# Altium schematic sheet P07_eMMC.SchDoc
size A
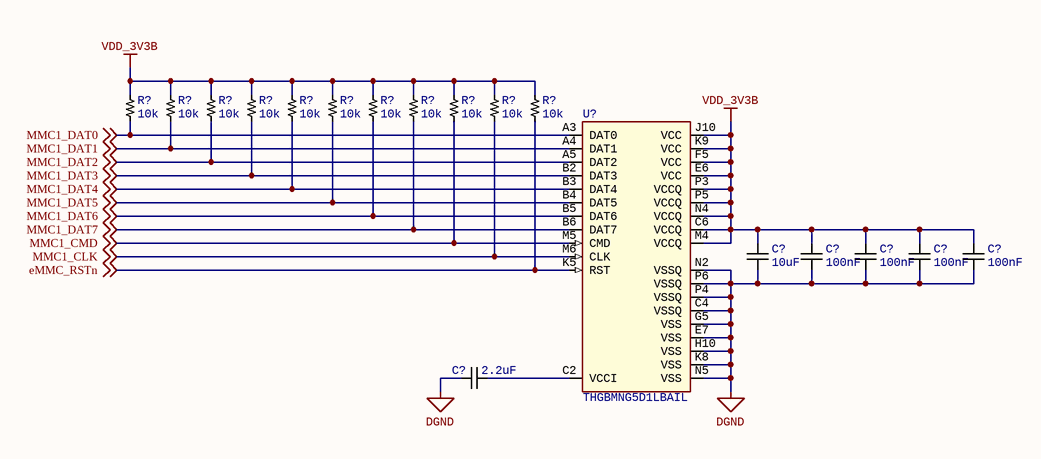
[diagram p0: P07_eMMC.SchDoc]

## Parts
(Parts that share a designator on the sheet are numbered #1, #2 ... from top to bottom, then left to right.)
C?#1  Capacitance: 10uF  [CAP0805]  (hidden comment: C2012X6S1A106K085AC)
C?#2  Capacitance: 100nF  [CAP0402]  (hidden comment: C0402C104K4RACTU)
C?#3  Capacitance: 100nF  [CAP0402]  (hidden comment: C0402C104K4RACTU)
C?#4  Capacitance: 100nF  [CAP0402]  (hidden comment: C0402C104K4RACTU)
C?#5  Capacitance: 100nF  [CAP0402]  (hidden comment: C0402C104K4RACTU)
C?#6  Capacitance: 2.2uF  [CAP0402]  (hidden comment: C1005X5R0J225K050BC)
R?#1  Resistance: 10k  [RES0402]  (hidden comment: RC0402FR-0710KL)
R?#2  Resistance: 10k  [RES0402]  (hidden comment: RC0402FR-0710KL)
R?#3  Resistance: 10k  [RES0402]  (hidden comment: RC0402FR-0710KL)
R?#4  Resistance: 10k  [RES0402]  (hidden comment: RC0402FR-0710KL)
R?#5  Resistance: 10k  [RES0402]  (hidden comment: RC0402FR-0710KL)
R?#6  Resistance: 10k  [RES0402]  (hidden comment: RC0402FR-0710KL)
R?#7  Resistance: 10k  [RES0402]  (hidden comment: RC0402FR-0710KL)
R?#8  Resistance: 10k  [RES0402]  (hidden comment: RC0402FR-0710KL)
R?#9  Resistance: 10k  [RES0402]  (hidden comment: RC0402FR-0710KL)
R?#10  Resistance: 10k  [RES0402]  (hidden comment: RC0402FR-0710KL)
R?#11  Resistance: 10k  [RES0402]  (hidden comment: RC0402FR-0710KL)
U?  THGBMNG5D1LBAIL  [WFBGA-153]

## Nets
DGND: C?#1.1 C?#2.2 C?#3.2 C?#4.2 C?#5.2 C?#6.2 U?.C4(VSSQ) U?.E7(VSS) U?.G5(VSS) U?.H10(VSS) U?.K8(VSS) U?.N2(VSSQ) U?.N5(VSS) U?.P4(VSSQ) U?.P6(VSSQ)
VDD_3V3B: C?#1.2 C?#2.1 C?#3.1 C?#4.1 C?#5.1 R?#1.2 R?#2.2 R?#3.2 R?#4.2 R?#5.2 R?#6.2 R?#7.2 R?#8.2 R?#9.2 R?#10.2 R?#11.2 U?.C6(VCCQ) U?.E6(VCC) U?.F5(VCC) U?.J10(VCC) U?.K9(VCC) U?.M4(VCCQ) U?.N4(VCCQ) U?.P3(VCCQ) U?.P5(VCCQ)
eMMC_RSTn: R?#11.1 U?.K5(RST) ; off-sheet eMMC_RSTn
MMC1_CLK: R?#10.1 U?.M6(CLK) ; off-sheet MMC1_CLK
MMC1_CMD: R?#9.1 U?.M5(CMD) ; off-sheet MMC1_CMD
MMC1_DAT0: R?#1.1 U?.A3(DAT0) ; off-sheet MMC1_DAT0
MMC1_DAT1: R?#2.1 U?.A4(DAT1) ; off-sheet MMC1_DAT1
MMC1_DAT2: R?#3.1 U?.A5(DAT2) ; off-sheet MMC1_DAT2
MMC1_DAT3: R?#4.1 U?.B2(DAT3) ; off-sheet MMC1_DAT3
MMC1_DAT4: R?#5.1 U?.B3(DAT4) ; off-sheet MMC1_DAT4
MMC1_DAT5: R?#6.1 U?.B4(DAT5) ; off-sheet MMC1_DAT5
MMC1_DAT6: R?#7.1 U?.B5(DAT6) ; off-sheet MMC1_DAT6
MMC1_DAT7: R?#8.1 U?.B6(DAT7) ; off-sheet MMC1_DAT7
NetC?#6_1: C?#6.1 U?.C2(VCCI)

## Notes on the sheet
- Title
- Size:
- Date:
- A
- Number:
- Time:
- Revision:
- Sheet
- of
- File:

## Library data of the parts
C?#1 = CAP_10uF: MLCC 10uF 0805 SMD; Manufacturer: TDK; Tolerance: 10%; Dielectric Material: Ceramic; Voltage Rating: 10V; Dielectric: X6S; Supplier 1: Digi-Key; Supplier Part Number 1: 445-7613-1-ND; Manufacturer Part Number: C2012X6S1A106K085AC; RoHS: Yes; Stock 1: 46852; Pricing 1: 1=0.30000, 10=0.20500, 100=0.11610, 500=0.08198, 1000=0.07173 (USD); Packaging: Tape and Reel; Mount: Surface Mount; Case/Package: 0805; Weight: 0.000194oz; Case Code (Metric): 2012; Case Code (Imperial): 0805; Min Operating Temperature: -55°C; Max Operating Temperature: 105°C; Termination: SMD/SMT; Package Quantity: 4000; Voltage Rating (DC): 10V; Composition: Ceramic; Length: 2mm; Height: 1.25mm; Depth: 1.25mm; Width: 0.049inch; Thickness: 0.037inch; REACH SVHC: No SVHC; Lead Free: Lead Free; ComponentLink3URL: https://datasheet.ciiva.com/6290/tdkmlcccaprange-6290501.pdf?src-supplier=Digi-Key; ComponentLink3Description: Datasheet
C?#2-C?#5 = CAP_100nF: MLCC 100nF 0402 SMD; Manufacturer: KEMET; Tolerance: 10%; Voltage Rating (DC): 16V; Dielectric: X7R; Dissipation Factor: 3.5%; Supplier 1: Digi-Key; Manufacturer Part Number: C0402C104K4RACTU; Stock 1: 6512243; Pricing 1: 1=0.10000, 10=0.04200, 100=0.01860, 500=0.01328, 1000=0.01044, 2500=0.00949, 5000=0.00873 (USD); RoHS: Yes; Mount: Surface Mount; Case/Package: 0402; Case Code (Imperial): 0402; Case Code (Metric): 1005; Contact Plating: Tin,Matte; Min Operating Temperature: -55°C; Max Operating Temperature: 125°C; Packaging: Tape and Reel; Package Quantity: 10000; Voltage Rating: 16V; Termination: SMD/SMT; Length: 1mm; Height: 0.5mm; Width: 0.5mm; Depth: 0.5mm; Radiation Hardening: No; ComponentLink2URL: https://datasheet.ciiva.com/18192/getdatasheetpartid-385384-18192412.pdf?src-supplier=Verical; ComponentLink2Description: Datasheet; Supplier Part Number 1: 399-3521-1-ND
C?#6 = CAP_2.2uF: MLCC 2.2uF 0402 SMD; Manufacturer: TDK; Dielectric Material: Ceramic; Tolerance: 10%; Dielectric: X5R; Voltage Rating: 6.3V; Supplier 1: Digi-Key; Manufacturer Part Number: C1005X5R0J225K050BC; Stock 1: 256055; Pricing 1: 1=0.20000, 10=0.13800, 100=0.07010, 500=0.04794, 1000=0.04240, 2500=0.04056, 5000=0.03687 (USD); RoHS: Yes; Mount: Surface Mount; Case/Package: 0402; Number of Pins: 2; Weight: 2.3E-05oz; Case Code (Metric): 1005; Case Code (Imperial): 0402; Min Operating Temperature: -55°C; Max Operating Temperature: 85°C; Packaging: Tape and Reel; Voltage Rating (DC): 6.3V; Termination: SMD/SMT; Package Quantity: 1; Composition: Ceramic; Voltage: 6.3V; Length: 1mm; Height: 0.5mm; Width: 0.02inch; Depth: 0.5mm; Thickness: 0.022inch; Radiation Hardening: No; Lead Free: Lead Free; REACH SVHC: No SVHC; ComponentLink7Description: Datasheet; ComponentLink7URL: https://product.tdk.com/info/en/catalog/datasheets/mlcc_commercial_general_en.pdf?ref_disty=digikey
R?#1-R?#11 = RES_10k: Resistor 10kOhm 0402 SMD; Manufacturer: Yageo; Temperature Coefficient: 100ppm/°C; Tolerance: 1%; Voltage Rating (DC): 50V; Power Rating: 62.5mW; ComponentLink1Description: https://datasheet.ciiva.com/7660/38568-7660787.pdf?src-supplier=Element14; ComponentLink1URL: https://datasheet.ciiva.com/7660/38568-7660787.pdf?src-supplier=Element14; Composition: Thick Film; Height: 0.32mm; Manufacturer Part Number: RC0402FR-0710KL; Number of Terminations: 2; Packaging: Tape and Reel; Pricing 1: 1=0.10000, 10=0.01500, 100=0.00600, 1000=0.00270, 2500=0.00235, 5000=0.00194 (USD); RoHS: Yes; Stock 1: 72891652; Supplier 1: Digi-Key; Case/Package: 0402; Number of Pins: 2; Case Code (Imperial): 0402; Case Code (Metric): 1005; Min Operating Temperature: -55°C; Max Operating Temperature: 155°C; Voltage Rating: 50V; Termination: SMD/SMT; Military Standard: Not; Working Voltage: 50V; Length: 1mm; Width: 0.5mm; Depth: 0.5mm; Lead Pitch: 0.2mm; REACH SVHC: No SVHC; Lead Free: Lead Free; ComponentLink2URL: https://datasheet.ciiva.com/7983/1018594-7983486.pdf?src-supplier=Element14; ComponentLink2Description: https://datasheet.ciiva.com/7983/1018594-7983486.pdf?src-supplier=Element14; ComponentLink3URL: https://datasheet.ciiva.com/7849/1784430-7849813.pdf?src-supplier=Element14; ComponentLink3Description: https://datasheet.ciiva.com/7849/1784430-7849813.pdf?src-supplier=Element14; ComponentLink4URL: https://datasheet.ciiva.com/7849/1686128-7849814.pdf?src-supplier=Element14; ComponentLink4Description: https://datasheet.ciiva.com/7849/1686128-7849814.pdf?src-supplier=Element14; ComponentLink5URL: https://datasheet.ciiva.com/7849/1784430-7849815.pdf?src-supplier=Element14; ComponentLink5Description: https://datasheet.ciiva.com/7849/1784430-7849815.pdf?src-supplier=Element14; ComponentLink6URL: https://datasheet.ciiva.com/22747/1018594-22747512.pdf?src-supplier=Element14; ComponentLink6Description: https://datasheet.ciiva.com/22747/1018594-22747512.pdf?src-supplier=Element14; ComponentLink7URL: https://datasheet.ciiva.com/12667/pyu-rc0402-51-rohs-l-6-r-12667067.pdf?src-supplier=Mouser; ComponentLink7Description: https://datasheet.ciiva.com/12667/pyu-rc0402-51-rohs-l-6-r-12667067.pdf?src-supplier=Mouser
U? = IC_eMMC: Flash Card 4G-byte 3.3V MultiMedia Card 153-Pin WFBGA; Manufacturer: Micron Technology; Manufacturer Part Number: MTFC2GMVEA-0M WT; Lead Time: 2 weeks; Supplier 1: Arrow; Supplier Part Number 1: 53710993S251949N2406; RoHS: CHINA ROHS: Compliant / EU ROHS: Compliant; Stock 1: 1009; Pricing 1: 0=7.21 (USD); Package Quantity: 1; EU_ROHS_PROD_EXEMPTION_BY_SUPP: N/R; ComponentLink1URL: https://www.digikey.com/product-detail/en/kioxia-america-inc/THGBMNG5D1LBAIL/THGBMNG5D1LBAIL-ND/9841782; ComponentLink1Description: Digikey; Supplier 2: Mouser; Stock 2: 1469; Pricing 2: 1=5.85000, 10=5.34000, 25=5.24000, 50=5.20000, 100=4.67000, 250=4.65000, 500=4.36000, 1000=4.17000, 2500=3.91000 (USD); Supplier Part Number 2: 757-THGBMNG5D1LBAIL